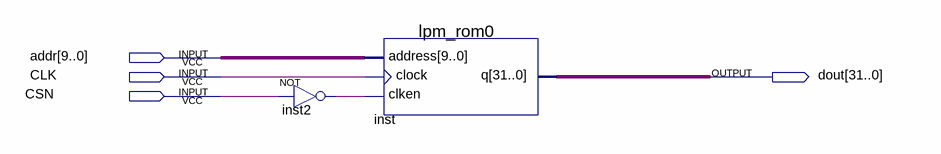
[diagram p0: schematic sheet]
// Quartus schematic IMEM.bdf as structural Verilog: 2 symbols, 4 pins
module IMEM (
  input  [9:0] addr,
  input  CLK,
  input  CSN,
  output [31:0] dout
);

  wire inst2_out;

  not inst2 (inst2_out, CSN);
  lpm_rom0 inst (.address(addr), .clock(CLK), .clken(inst2_out), .q(dout));
endmodule
